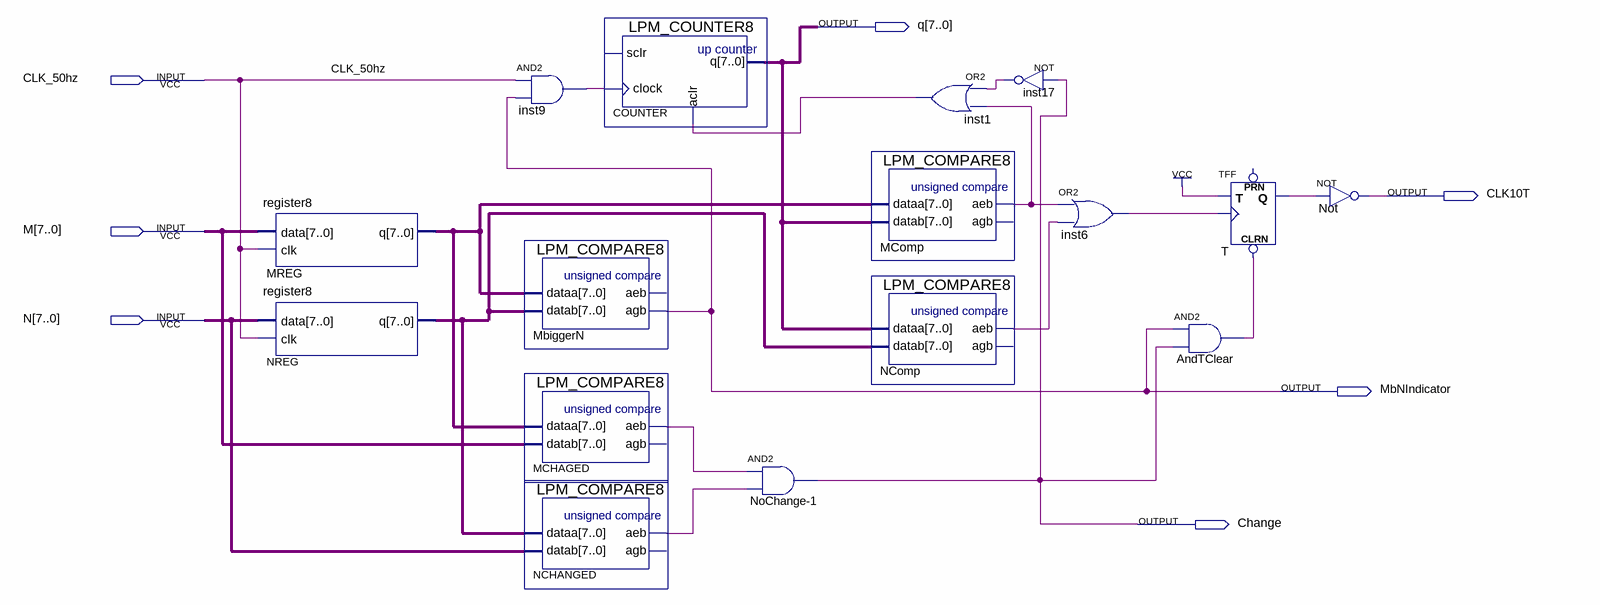
[diagram p0: schematic sheet]
// Quartus schematic Block_dop.bdf as structural Verilog: 16 symbols, 7 pins
module Block_dop (
  input  CLK_50hz,
  input  [7:0] M,
  input  [7:0] N,
  output [7:0] q,
  output CLK10T,
  output MbNIndicator,
  output Change
);

  wire AndTClear_out, inst1_out, inst6_out, inst9_out, inst17_out, MCHAGED_aeb, MComp_aeb, NCHANGED_aeb,
       NComp_aeb, T_q;
  wire [7:0] MREG_q, NREG_q;

  register8 MREG (.data(M), .clk(CLK_50hz), .q(MREG_q));
  register8 NREG (.data(N), .clk(CLK_50hz), .q(NREG_q));
  and inst9 (inst9_out, CLK_50hz, MbNIndicator);
  LPM_COMPARE8 MbiggerN (.dataa(MREG_q), .datab(NREG_q), .agb(MbNIndicator));  // open: aeb
  LPM_COMPARE8 MCHAGED (.dataa(MREG_q), .datab(M), .aeb(MCHAGED_aeb));  // open: agb
  LPM_COMPARE8 NCHANGED (.dataa(NREG_q), .datab(N), .aeb(NCHANGED_aeb));  // open: agb
  LPM_COUNTER8 COUNTER (.clock(inst9_out), .aclr(inst1_out), .q(q));  // open: sclr
  and \NoChange-1  (Change, MCHAGED_aeb, NCHANGED_aeb);
  LPM_COMPARE8 MComp (.dataa(MREG_q), .datab(q), .aeb(MComp_aeb));  // open: agb
  LPM_COMPARE8 NComp (.dataa(q), .datab(NREG_q), .aeb(NComp_aeb));  // open: agb
  or inst1 (inst1_out, inst17_out, MComp_aeb);
  not inst17 (inst17_out, Change);
  or inst6 (inst6_out, MComp_aeb, NComp_aeb);
  TFF T (.CLRN(AndTClear_out), .T(1'b1), .CLK(inst6_out), .Q(T_q));  // open: PRN
  and AndTClear (AndTClear_out, MbNIndicator, Change);
  not Not (CLK10T, T_q);
endmodule
